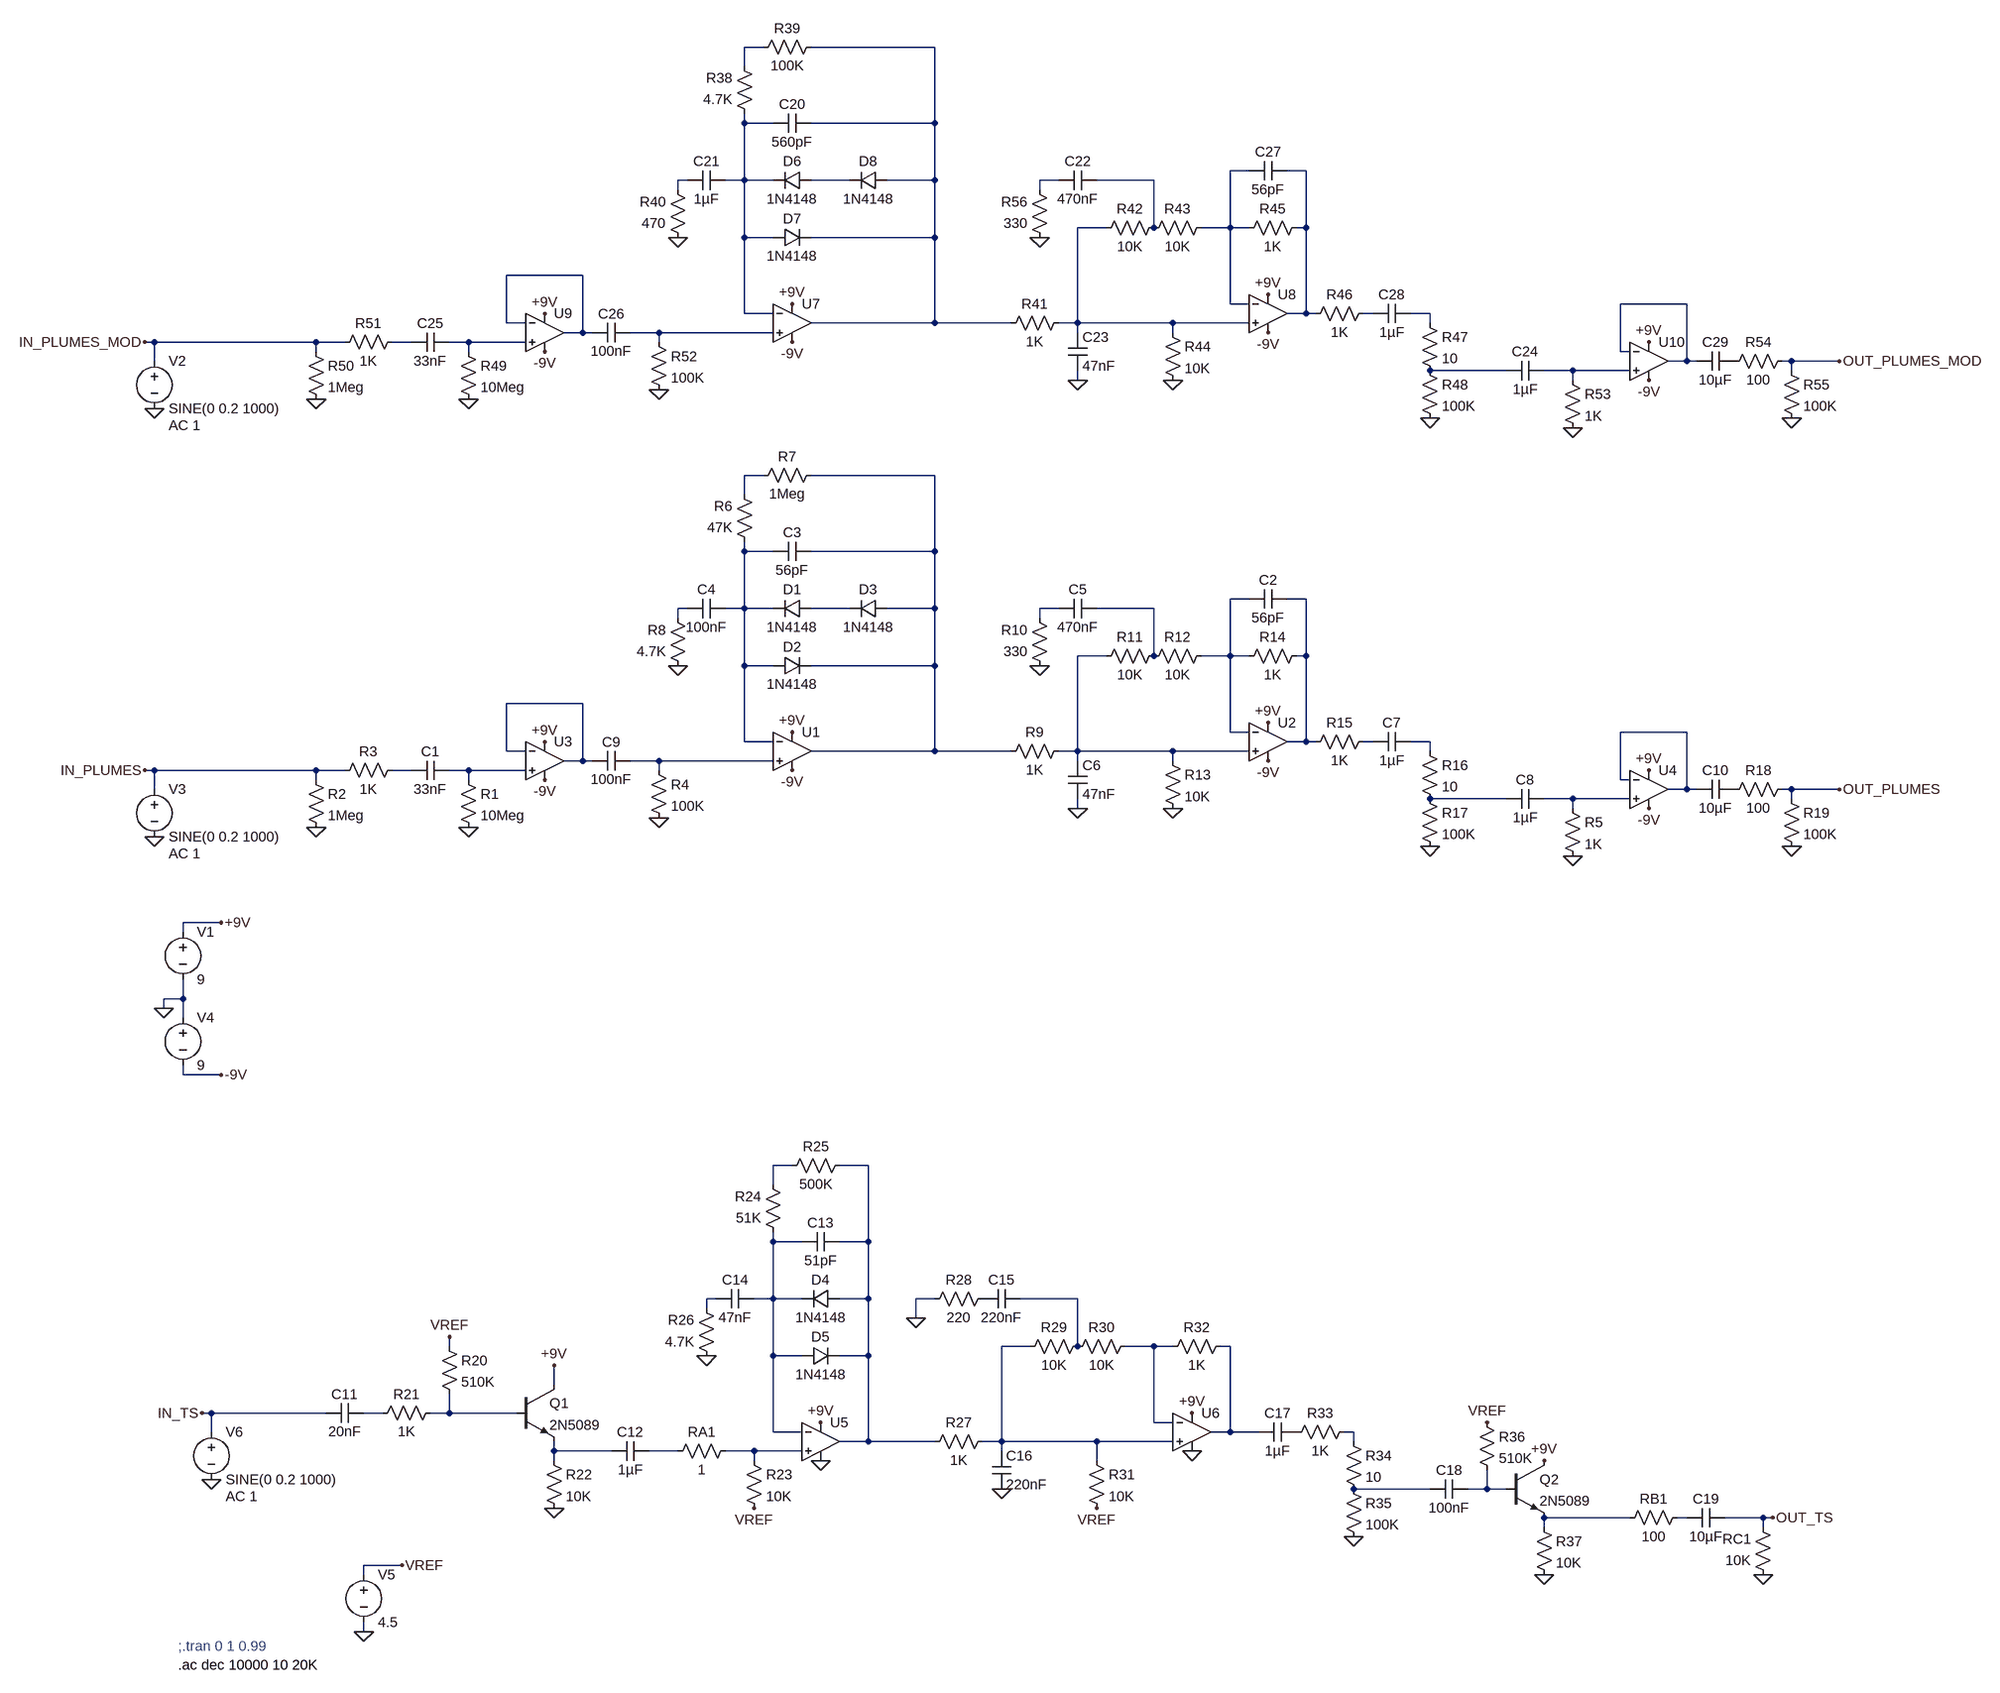
[diagram p0: schematic plumes_TS_sim.asc]
plumes_TS_sim.asc, the LTspice schematic file:
Version 4
SHEET 1 2708 1688
WIRE 608 -1072 576 -1072
WIRE 896 -1072 688 -1072
WIRE 576 -1040 576 -1072
WIRE 576 -944 576 -960
WIRE 624 -944 576 -944
WIRE 896 -944 896 -1072
WIRE 896 -944 688 -944
WIRE 1424 -864 1392 -864
WIRE 1520 -864 1488 -864
WIRE 480 -848 464 -848
WIRE 576 -848 576 -944
WIRE 576 -848 544 -848
WIRE 624 -848 576 -848
WIRE 752 -848 688 -848
WIRE 896 -848 896 -944
WIRE 896 -848 816 -848
WIRE 1104 -848 1072 -848
WIRE 1264 -848 1168 -848
WIRE 464 -832 464 -848
WIRE 1072 -832 1072 -848
WIRE 1184 -768 1136 -768
WIRE 1264 -768 1264 -848
WIRE 1392 -768 1392 -864
WIRE 1392 -768 1344 -768
WIRE 1424 -768 1392 -768
WIRE 1520 -768 1520 -864
WIRE 1520 -768 1504 -768
WIRE 576 -752 576 -848
WIRE 624 -752 576 -752
WIRE 896 -752 896 -848
WIRE 896 -752 688 -752
WIRE 304 -688 176 -688
WIRE 1392 -640 1392 -768
WIRE 1424 -640 1392 -640
WIRE 2160 -640 2048 -640
WIRE 576 -624 576 -752
WIRE 624 -624 576 -624
WIRE 1520 -624 1520 -768
WIRE 1520 -624 1488 -624
WIRE 1536 -624 1520 -624
WIRE 1632 -624 1616 -624
WIRE 1728 -624 1696 -624
WIRE 176 -608 176 -688
WIRE 208 -608 176 -608
WIRE 896 -608 896 -752
WIRE 896 -608 688 -608
WIRE 1024 -608 896 -608
WIRE 1136 -608 1136 -768
WIRE 1136 -608 1104 -608
WIRE 1296 -608 1136 -608
WIRE 1424 -608 1296 -608
WIRE 1728 -608 1728 -624
WIRE 304 -592 304 -688
WIRE 304 -592 272 -592
WIRE 320 -592 304 -592
WIRE 432 -592 384 -592
WIRE 624 -592 432 -592
WIRE 1136 -592 1136 -608
WIRE 1296 -592 1296 -608
WIRE -416 -576 -432 -576
WIRE -144 -576 -416 -576
WIRE -96 -576 -144 -576
WIRE 16 -576 -16 -576
WIRE 112 -576 80 -576
WIRE 208 -576 112 -576
WIRE 432 -576 432 -592
WIRE -144 -560 -144 -576
WIRE 112 -560 112 -576
WIRE 2048 -560 2048 -640
WIRE 2064 -560 2048 -560
WIRE -416 -544 -416 -576
WIRE 2160 -544 2160 -640
WIRE 2160 -544 2128 -544
WIRE 2176 -544 2160 -544
WIRE 2336 -544 2320 -544
WIRE 2416 -544 2336 -544
WIRE 1856 -528 1728 -528
WIRE 1968 -528 1920 -528
WIRE 2064 -528 1968 -528
WIRE 2336 -528 2336 -544
WIRE 1136 -512 1136 -528
WIRE 1968 -512 1968 -528
WIRE 608 -352 576 -352
WIRE 896 -352 688 -352
WIRE 576 -320 576 -352
WIRE 576 -224 576 -240
WIRE 624 -224 576 -224
WIRE 896 -224 896 -352
WIRE 896 -224 688 -224
WIRE 1424 -144 1392 -144
WIRE 1520 -144 1488 -144
WIRE 480 -128 464 -128
WIRE 576 -128 576 -224
WIRE 576 -128 544 -128
WIRE 624 -128 576 -128
WIRE 752 -128 688 -128
WIRE 896 -128 896 -224
WIRE 896 -128 816 -128
WIRE 1104 -128 1072 -128
WIRE 1264 -128 1168 -128
WIRE 464 -112 464 -128
WIRE 1072 -112 1072 -128
WIRE 1184 -48 1136 -48
WIRE 1264 -48 1264 -128
WIRE 1392 -48 1392 -144
WIRE 1392 -48 1344 -48
WIRE 1424 -48 1392 -48
WIRE 1520 -48 1520 -144
WIRE 1520 -48 1504 -48
WIRE 576 -32 576 -128
WIRE 624 -32 576 -32
WIRE 896 -32 896 -128
WIRE 896 -32 688 -32
WIRE 304 32 176 32
WIRE 1392 80 1392 -48
WIRE 1424 80 1392 80
WIRE 2160 80 2048 80
WIRE 576 96 576 -32
WIRE 624 96 576 96
WIRE 1520 96 1520 -48
WIRE 1520 96 1488 96
WIRE 1536 96 1520 96
WIRE 1632 96 1616 96
WIRE 1728 96 1696 96
WIRE 176 112 176 32
WIRE 208 112 176 112
WIRE 896 112 896 -32
WIRE 896 112 688 112
WIRE 1024 112 896 112
WIRE 1136 112 1136 -48
WIRE 1136 112 1104 112
WIRE 1296 112 1136 112
WIRE 1424 112 1296 112
WIRE 1728 112 1728 96
WIRE 304 128 304 32
WIRE 304 128 272 128
WIRE 320 128 304 128
WIRE 432 128 384 128
WIRE 624 128 432 128
WIRE 1136 128 1136 112
WIRE 1296 128 1296 112
WIRE -416 144 -432 144
WIRE -144 144 -416 144
WIRE -96 144 -144 144
WIRE 16 144 -16 144
WIRE 112 144 80 144
WIRE 208 144 112 144
WIRE 432 144 432 128
WIRE -144 160 -144 144
WIRE 112 160 112 144
WIRE 2048 160 2048 80
WIRE 2064 160 2048 160
WIRE -416 176 -416 144
WIRE 2160 176 2160 80
WIRE 2160 176 2128 176
WIRE 2176 176 2160 176
WIRE 2336 176 2320 176
WIRE 2416 176 2336 176
WIRE 1856 192 1728 192
WIRE 1968 192 1920 192
WIRE 2064 192 1968 192
WIRE 2336 192 2336 176
WIRE 1136 208 1136 192
WIRE 1968 208 1968 192
WIRE -304 400 -368 400
WIRE -368 416 -368 400
WIRE -368 528 -368 496
WIRE -368 528 -400 528
WIRE -400 544 -400 528
WIRE -368 560 -368 528
WIRE -368 656 -368 640
WIRE -304 656 -368 656
WIRE 656 832 624 832
WIRE 784 832 736 832
WIRE 624 864 624 832
WIRE 624 960 624 944
WIRE 672 960 624 960
WIRE 784 960 784 832
WIRE 784 960 736 960
WIRE 528 1056 512 1056
WIRE 624 1056 624 960
WIRE 624 1056 592 1056
WIRE 672 1056 624 1056
WIRE 784 1056 784 960
WIRE 784 1056 736 1056
WIRE 896 1056 864 1056
WIRE 1136 1056 1040 1056
WIRE 512 1072 512 1056
WIRE 864 1088 864 1056
WIRE 80 1136 80 1120
WIRE 1056 1136 1008 1136
WIRE 1136 1136 1136 1056
WIRE 1264 1136 1216 1136
WIRE 1296 1136 1264 1136
WIRE 1392 1136 1376 1136
WIRE 624 1152 624 1056
WIRE 672 1152 624 1152
WIRE 784 1152 784 1056
WIRE 784 1152 736 1152
WIRE 256 1200 256 1168
WIRE -320 1248 -336 1248
WIRE -128 1248 -320 1248
WIRE -32 1248 -64 1248
WIRE 80 1248 80 1216
WIRE 80 1248 48 1248
WIRE 192 1248 80 1248
WIRE 1264 1264 1264 1136
WIRE 1296 1264 1264 1264
WIRE -320 1280 -320 1248
WIRE 624 1280 624 1152
WIRE 672 1280 624 1280
WIRE 1392 1280 1392 1136
WIRE 1392 1280 1360 1280
WIRE 1440 1280 1392 1280
WIRE 1600 1280 1584 1280
WIRE 784 1296 784 1152
WIRE 784 1296 736 1296
WIRE 896 1296 784 1296
WIRE 1008 1296 1008 1136
WIRE 1008 1296 976 1296
WIRE 1168 1296 1008 1296
WIRE 1296 1296 1168 1296
WIRE 1600 1296 1600 1280
WIRE 256 1312 256 1296
WIRE 352 1312 256 1312
WIRE 464 1312 416 1312
WIRE 592 1312 544 1312
WIRE 672 1312 592 1312
WIRE 1008 1312 1008 1296
WIRE 256 1328 256 1312
WIRE 592 1328 592 1312
WIRE 1168 1328 1168 1296
WIRE 1728 1376 1600 1376
WIRE 1824 1376 1824 1344
WIRE 1824 1376 1792 1376
WIRE 1856 1376 1824 1376
WIRE 2064 1424 1920 1424
WIRE 2160 1424 2144 1424
WIRE 2288 1424 2224 1424
WIRE 2304 1424 2288 1424
WIRE 1920 1440 1920 1424
WIRE 2288 1440 2288 1424
WIRE 0 1504 -64 1504
WIRE -64 1520 -64 1504
WIRE -64 1616 -64 1600
FLAG -304 400 +9V
FLAG -416 256 0
FLAG -432 144 IN_PLUMES
FLAG 464 -32 0
FLAG 656 80 +9V
FLAG 1136 208 0
FLAG 1456 64 +9V
FLAG 1728 272 0
FLAG -144 240 0
FLAG 112 240 0
FLAG 240 96 +9V
FLAG -400 544 0
FLAG -304 656 -9V
FLAG 240 160 -9V
FLAG 432 224 0
FLAG 1296 208 0
FLAG 1968 288 0
FLAG 656 144 -9V
FLAG 1456 128 -9V
FLAG 2096 208 -9V
FLAG 2096 144 +9V
FLAG 2336 272 0
FLAG 2416 176 OUT_PLUMES
FLAG 1072 -32 0
FLAG 256 1408 0
FLAG -64 1616 0
FLAG 0 1504 VREF
FLAG 256 1168 +9V
FLAG 80 1120 VREF
FLAG 592 1408 VREF
FLAG -320 1360 0
FLAG -336 1248 IN_TS
FLAG 512 1152 0
FLAG 704 1264 +9V
FLAG 704 1328 0
FLAG 864 1088 0
FLAG 1008 1376 0
FLAG 1168 1408 VREF
FLAG 1328 1248 +9V
FLAG 1328 1312 0
FLAG 1600 1456 0
FLAG 1824 1264 VREF
FLAG 1920 1520 0
FLAG 1920 1328 +9V
FLAG 2288 1520 0
FLAG 2304 1424 OUT_TS
FLAG -416 -464 0
FLAG -432 -576 IN_PLUMES_MOD
FLAG 464 -752 0
FLAG 656 -640 +9V
FLAG 1136 -512 0
FLAG 1456 -656 +9V
FLAG 1728 -448 0
FLAG -144 -480 0
FLAG 112 -480 0
FLAG 240 -624 +9V
FLAG 240 -560 -9V
FLAG 432 -496 0
FLAG 1296 -512 0
FLAG 1968 -432 0
FLAG 656 -576 -9V
FLAG 1456 -592 -9V
FLAG 2096 -512 -9V
FLAG 2096 -576 +9V
FLAG 2336 -448 0
FLAG 2416 -544 OUT_PLUMES_MOD
FLAG 1072 -752 0
SYMBOL voltage -368 400 R0
WINDOW 123 0 0 Left 0
WINDOW 39 0 0 Left 0
SYMATTR InstName V1
SYMATTR Value 9
SYMBOL voltage -416 160 R0
WINDOW 123 24 124 Left 2
WINDOW 39 0 0 Left 0
SYMATTR Value2 AC 1
SYMATTR InstName V3
SYMATTR Value SINE(0 0.2 1000)
SYMBOL diode 688 -144 R90
WINDOW 0 0 32 VBottom 2
WINDOW 3 32 32 VTop 2
SYMATTR InstName D1
SYMATTR Value 1N4148
SYMBOL diode 624 -16 R270
WINDOW 0 32 32 VTop 2
WINDOW 3 0 32 VBottom 2
SYMATTR InstName D2
SYMATTR Value 1N4148
SYMBOL cap 688 -240 R90
WINDOW 0 0 32 VBottom 2
WINDOW 3 32 32 VTop 2
SYMATTR InstName C3
SYMATTR Value 56pF
SYMBOL res 592 -224 R180
WINDOW 0 36 76 Left 2
WINDOW 3 36 40 Left 2
SYMATTR InstName R6
SYMATTR Value 47K
SYMBOL res 704 -368 R90
WINDOW 0 0 56 VBottom 2
WINDOW 3 32 56 VTop 2
SYMATTR InstName R7
SYMATTR Value 1Meg
SYMBOL cap 544 -144 R90
WINDOW 0 0 32 VBottom 2
WINDOW 3 32 32 VTop 2
SYMATTR InstName C4
SYMATTR Value 100nF
SYMBOL res 480 -16 R180
WINDOW 0 36 76 Left 2
WINDOW 3 36 40 Left 2
SYMATTR InstName R8
SYMATTR Value 4.7K
SYMBOL res 1120 96 R90
WINDOW 0 0 56 VBottom 2
WINDOW 3 32 56 VTop 2
SYMATTR InstName R9
SYMATTR Value 1K
SYMBOL cap 1168 -144 R90
WINDOW 0 0 32 VBottom 2
WINDOW 3 32 32 VTop 2
SYMATTR InstName C5
SYMATTR Value 470nF
SYMBOL res 1280 -64 R90
WINDOW 0 0 56 VBottom 2
WINDOW 3 32 56 VTop 2
SYMATTR InstName R11
SYMATTR Value 10K
SYMBOL res 1360 -64 R90
WINDOW 0 0 56 VBottom 2
WINDOW 3 32 56 VTop 2
SYMATTR InstName R12
SYMATTR Value 10K
SYMBOL cap 1120 128 R0
SYMATTR InstName C6
SYMATTR Value 47nF
SYMBOL res 1280 112 R0
SYMATTR InstName R13
SYMATTR Value 10K
SYMBOL res 1520 -64 R90
WINDOW 0 0 56 VBottom 2
WINDOW 3 32 56 VTop 2
SYMATTR InstName R14
SYMATTR Value 1K
SYMBOL res 1632 80 R90
WINDOW 0 0 56 VBottom 2
WINDOW 3 32 56 VTop 2
SYMATTR InstName R15
SYMATTR Value 1K
SYMBOL res 1712 96 R0
SYMATTR InstName R16
SYMATTR Value 10
SYMBOL res 1712 176 R0
SYMATTR InstName R17
SYMATTR Value 100K
SYMBOL cap 1920 176 R90
WINDOW 0 0 32 VBottom 2
WINDOW 3 32 32 VTop 2
SYMATTR InstName C8
SYMATTR Value 1µF
SYMBOL UniversalOpAmp2 656 112 R0
SYMATTR InstName U1
SYMBOL UniversalOpAmp2 1456 96 R0
SYMATTR InstName U2
SYMBOL UniversalOpAmp2 240 128 R0
SYMATTR InstName U3
SYMBOL res 96 144 R0
SYMATTR InstName R1
SYMATTR Value 10Meg
SYMBOL res -160 144 R0
SYMATTR InstName R2
SYMATTR Value 1Meg
SYMBOL res 0 128 R90
WINDOW 0 0 56 VBottom 2
WINDOW 3 32 56 VTop 2
SYMATTR InstName R3
SYMATTR Value 1K
SYMBOL cap 80 128 R90
WINDOW 0 0 32 VBottom 2
WINDOW 3 32 32 VTop 2
SYMATTR InstName C1
SYMATTR Value 33nF
SYMBOL voltage -368 544 R0
WINDOW 123 0 0 Left 0
WINDOW 39 0 0 Left 0
SYMATTR InstName V4
SYMATTR Value 9
SYMBOL cap 384 112 R90
WINDOW 0 0 32 VBottom 2
WINDOW 3 32 32 VTop 2
SYMATTR InstName C9
SYMATTR Value 100nF
SYMBOL res 416 128 R0
SYMATTR InstName R4
SYMATTR Value 100K
SYMBOL cap 1488 -160 R90
WINDOW 0 0 32 VBottom 2
WINDOW 3 32 32 VTop 2
SYMATTR InstName C2
SYMATTR Value 56pF
SYMBOL cap 1696 80 R90
WINDOW 0 0 32 VBottom 2
WINDOW 3 32 32 VTop 2
SYMATTR InstName C7
SYMATTR Value 1µF
SYMBOL res 1952 192 R0
SYMATTR InstName R5
SYMATTR Value 1K
SYMBOL UniversalOpAmp2 2096 176 R0
SYMATTR InstName U4
SYMBOL cap 2240 160 R90
WINDOW 0 0 32 VBottom 2
WINDOW 3 32 32 VTop 2
SYMATTR InstName C10
SYMATTR Value 10µF
SYMBOL res 2336 160 R90
WINDOW 0 0 56 VBottom 2
WINDOW 3 32 56 VTop 2
SYMATTR InstName R18
SYMATTR Value 100
SYMBOL res 2320 176 R0
SYMATTR InstName R19
SYMATTR Value 100K
SYMBOL diode 816 -144 R90
WINDOW 0 0 32 VBottom 2
WINDOW 3 32 32 VTop 2
SYMATTR InstName D3
SYMATTR Value 1N4148
SYMBOL res 1088 -16 R180
WINDOW 0 36 76 Left 2
WINDOW 3 36 40 Left 2
SYMATTR InstName R10
SYMATTR Value 330
SYMBOL npn 192 1200 R0
SYMATTR InstName Q1
SYMATTR Value 2N5089
SYMBOL res 64 1120 R0
SYMATTR InstName R20
SYMATTR Value 510K
SYMBOL res 64 1232 R90
WINDOW 0 0 56 VBottom 2
WINDOW 3 32 56 VTop 2
SYMATTR InstName R21
SYMATTR Value 1K
SYMBOL res 240 1312 R0
SYMATTR InstName R22
SYMATTR Value 10K
SYMBOL res 560 1296 R90
WINDOW 0 0 56 VBottom 2
WINDOW 3 32 56 VTop 2
SYMATTR InstName RA1
SYMATTR Value 1
SYMBOL res 576 1312 R0
SYMATTR InstName R23
SYMATTR Value 10K
SYMBOL cap -64 1232 R90
WINDOW 0 0 32 VBottom 2
WINDOW 3 32 32 VTop 2
SYMATTR InstName C11
SYMATTR Value 20nF
SYMBOL cap 416 1296 R90
WINDOW 0 0 32 VBottom 2
WINDOW 3 32 32 VTop 2
SYMATTR InstName C12
SYMATTR Value 1µF
SYMBOL voltage -64 1504 R0
WINDOW 123 0 0 Left 0
WINDOW 39 0 0 Left 0
SYMATTR InstName V5
SYMATTR Value 4.5
SYMBOL voltage -320 1264 R0
WINDOW 123 24 124 Left 2
WINDOW 39 0 0 Left 0
SYMATTR Value2 AC 1
SYMATTR InstName V6
SYMATTR Value SINE(0 0.2 1000)
SYMBOL diode 736 1040 R90
WINDOW 0 0 32 VBottom 2
WINDOW 3 32 32 VTop 2
SYMATTR InstName D4
SYMATTR Value 1N4148
SYMBOL diode 672 1168 R270
WINDOW 0 32 32 VTop 2
WINDOW 3 0 32 VBottom 2
SYMATTR InstName D5
SYMATTR Value 1N4148
SYMBOL cap 736 944 R90
WINDOW 0 0 32 VBottom 2
WINDOW 3 32 32 VTop 2
SYMATTR InstName C13
SYMATTR Value 51pF
SYMBOL res 640 960 R180
WINDOW 0 36 76 Left 2
WINDOW 3 36 40 Left 2
SYMATTR InstName R24
SYMATTR Value 51K
SYMBOL res 752 816 R90
WINDOW 0 0 56 VBottom 2
WINDOW 3 32 56 VTop 2
SYMATTR InstName R25
SYMATTR Value 500K
SYMBOL cap 592 1040 R90
WINDOW 0 0 32 VBottom 2
WINDOW 3 32 32 VTop 2
SYMATTR InstName C14
SYMATTR Value 47nF
SYMBOL res 528 1168 R180
WINDOW 0 36 76 Left 2
WINDOW 3 36 40 Left 2
SYMATTR InstName R26
SYMATTR Value 4.7K
SYMBOL res 992 1280 R90
WINDOW 0 0 56 VBottom 2
WINDOW 3 32 56 VTop 2
SYMATTR InstName R27
SYMATTR Value 1K
SYMBOL res 992 1040 R90
WINDOW 0 0 56 VBottom 2
WINDOW 3 32 56 VTop 2
SYMATTR InstName R28
SYMATTR Value 220
SYMBOL cap 1040 1040 R90
WINDOW 0 0 32 VBottom 2
WINDOW 3 32 32 VTop 2
SYMATTR InstName C15
SYMATTR Value 220nF
SYMBOL res 1152 1120 R90
WINDOW 0 0 56 VBottom 2
WINDOW 3 32 56 VTop 2
SYMATTR InstName R29
SYMATTR Value 10K
SYMBOL res 1232 1120 R90
WINDOW 0 0 56 VBottom 2
WINDOW 3 32 56 VTop 2
SYMATTR InstName R30
SYMATTR Value 10K
SYMBOL cap 992 1312 R0
SYMATTR InstName C16
SYMATTR Value 220nF
SYMBOL res 1152 1312 R0
SYMATTR InstName R31
SYMATTR Value 10K
SYMBOL res 1392 1120 R90
WINDOW 0 0 56 VBottom 2
WINDOW 3 32 56 VTop 2
SYMATTR InstName R32
SYMATTR Value 1K
SYMBOL cap 1504 1264 R90
WINDOW 0 0 32 VBottom 2
WINDOW 3 32 32 VTop 2
SYMATTR InstName C17
SYMATTR Value 1µF
SYMBOL res 1600 1264 R90
WINDOW 0 0 56 VBottom 2
WINDOW 3 32 56 VTop 2
SYMATTR InstName R33
SYMATTR Value 1K
SYMBOL res 1584 1280 R0
SYMATTR InstName R34
SYMATTR Value 10
SYMBOL res 1584 1360 R0
SYMATTR InstName R35
SYMATTR Value 100K
SYMBOL cap 1792 1360 R90
WINDOW 0 0 32 VBottom 2
WINDOW 3 32 32 VTop 2
SYMATTR InstName C18
SYMATTR Value 100nF
SYMBOL res 1808 1248 R0
SYMATTR InstName R36
SYMATTR Value 510K
SYMBOL res 1904 1424 R0
SYMATTR InstName R37
SYMATTR Value 10K
SYMBOL npn 1856 1328 R0
SYMATTR InstName Q2
SYMATTR Value 2N5089
SYMBOL res 2160 1408 R90
WINDOW 0 0 56 VBottom 2
WINDOW 3 32 56 VTop 2
SYMATTR InstName RB1
SYMATTR Value 100
SYMBOL res 2304 1536 R180
WINDOW 0 36 76 Left 2
WINDOW 3 36 40 Left 2
SYMATTR InstName RC1
SYMATTR Value 10K
SYMBOL cap 2224 1408 R90
WINDOW 0 0 32 VBottom 2
WINDOW 3 32 32 VTop 2
SYMATTR InstName C19
SYMATTR Value 10µF
SYMBOL UniversalOpAmp2 704 1296 R0
SYMATTR InstName U5
SYMBOL UniversalOpAmp2 1328 1280 R0
SYMATTR InstName U6
SYMBOL voltage -416 -560 R0
WINDOW 123 24 124 Left 2
WINDOW 39 0 0 Left 0
SYMATTR Value2 AC 1
SYMATTR InstName V2
SYMATTR Value SINE(0 0.2 1000)
SYMBOL diode 688 -864 R90
WINDOW 0 0 32 VBottom 2
WINDOW 3 32 32 VTop 2
SYMATTR InstName D6
SYMATTR Value 1N4148
SYMBOL diode 624 -736 R270
WINDOW 0 32 32 VTop 2
WINDOW 3 0 32 VBottom 2
SYMATTR InstName D7
SYMATTR Value 1N4148
SYMBOL cap 688 -960 R90
WINDOW 0 0 32 VBottom 2
WINDOW 3 32 32 VTop 2
SYMATTR InstName C20
SYMATTR Value 560pF
SYMBOL res 592 -944 R180
WINDOW 0 36 76 Left 2
WINDOW 3 36 40 Left 2
SYMATTR InstName R38
SYMATTR Value 4.7K
SYMBOL res 704 -1088 R90
WINDOW 0 0 56 VBottom 2
WINDOW 3 32 56 VTop 2
SYMATTR InstName R39
SYMATTR Value 100K
SYMBOL cap 544 -864 R90
WINDOW 0 0 32 VBottom 2
WINDOW 3 32 32 VTop 2
SYMATTR InstName C21
SYMATTR Value 1µF
SYMBOL res 480 -736 R180
WINDOW 0 36 76 Left 2
WINDOW 3 36 40 Left 2
SYMATTR InstName R40
SYMATTR Value 470
SYMBOL res 1120 -624 R90
WINDOW 0 0 56 VBottom 2
WINDOW 3 32 56 VTop 2
SYMATTR InstName R41
SYMATTR Value 1K
SYMBOL cap 1168 -864 R90
WINDOW 0 0 32 VBottom 2
WINDOW 3 32 32 VTop 2
SYMATTR InstName C22
SYMATTR Value 470nF
SYMBOL res 1280 -784 R90
WINDOW 0 0 56 VBottom 2
WINDOW 3 32 56 VTop 2
SYMATTR InstName R42
SYMATTR Value 10K
SYMBOL res 1360 -784 R90
WINDOW 0 0 56 VBottom 2
WINDOW 3 32 56 VTop 2
SYMATTR InstName R43
SYMATTR Value 10K
SYMBOL cap 1120 -592 R0
SYMATTR InstName C23
SYMATTR Value 47nF
SYMBOL res 1280 -608 R0
SYMATTR InstName R44
SYMATTR Value 10K
SYMBOL res 1520 -784 R90
WINDOW 0 0 56 VBottom 2
WINDOW 3 32 56 VTop 2
SYMATTR InstName R45
SYMATTR Value 1K
SYMBOL res 1632 -640 R90
WINDOW 0 0 56 VBottom 2
WINDOW 3 32 56 VTop 2
SYMATTR InstName R46
SYMATTR Value 1K
SYMBOL res 1712 -624 R0
SYMATTR InstName R47
SYMATTR Value 10
SYMBOL res 1712 -544 R0
SYMATTR InstName R48
SYMATTR Value 100K
SYMBOL cap 1920 -544 R90
WINDOW 0 0 32 VBottom 2
WINDOW 3 32 32 VTop 2
SYMATTR InstName C24
SYMATTR Value 1µF
SYMBOL UniversalOpAmp2 656 -608 R0
SYMATTR InstName U7
SYMBOL UniversalOpAmp2 1456 -624 R0
SYMATTR InstName U8
SYMBOL UniversalOpAmp2 240 -592 R0
SYMATTR InstName U9
SYMBOL res 96 -576 R0
SYMATTR InstName R49
SYMATTR Value 10Meg
SYMBOL res -160 -576 R0
SYMATTR InstName R50
SYMATTR Value 1Meg
SYMBOL res 0 -592 R90
WINDOW 0 0 56 VBottom 2
WINDOW 3 32 56 VTop 2
SYMATTR InstName R51
SYMATTR Value 1K
SYMBOL cap 80 -592 R90
WINDOW 0 0 32 VBottom 2
WINDOW 3 32 32 VTop 2
SYMATTR InstName C25
SYMATTR Value 33nF
SYMBOL cap 384 -608 R90
WINDOW 0 0 32 VBottom 2
WINDOW 3 32 32 VTop 2
SYMATTR InstName C26
SYMATTR Value 100nF
SYMBOL res 416 -592 R0
SYMATTR InstName R52
SYMATTR Value 100K
SYMBOL cap 1488 -880 R90
WINDOW 0 0 32 VBottom 2
WINDOW 3 32 32 VTop 2
SYMATTR InstName C27
SYMATTR Value 56pF
SYMBOL cap 1696 -640 R90
WINDOW 0 0 32 VBottom 2
WINDOW 3 32 32 VTop 2
SYMATTR InstName C28
SYMATTR Value 1µF
SYMBOL res 1952 -528 R0
SYMATTR InstName R53
SYMATTR Value 1K
SYMBOL UniversalOpAmp2 2096 -544 R0
SYMATTR InstName U10
SYMBOL cap 2240 -560 R90
WINDOW 0 0 32 VBottom 2
WINDOW 3 32 32 VTop 2
SYMATTR InstName C29
SYMATTR Value 10µF
SYMBOL res 2336 -560 R90
WINDOW 0 0 56 VBottom 2
WINDOW 3 32 56 VTop 2
SYMATTR InstName R54
SYMATTR Value 100
SYMBOL res 2320 -544 R0
SYMATTR InstName R55
SYMATTR Value 100K
SYMBOL diode 816 -864 R90
WINDOW 0 0 32 VBottom 2
WINDOW 3 32 32 VTop 2
SYMATTR InstName D8
SYMATTR Value 1N4148
SYMBOL res 1088 -736 R180
WINDOW 0 36 76 Left 2
WINDOW 3 36 40 Left 2
SYMATTR InstName R56
SYMATTR Value 330
TEXT -376 1640 Left 2 ;;.tran 0 1 0.99
TEXT -376 1672 Left 2 !.ac dec 10000 10 20K

The netlist it stands for:
* plumes_TS_sim.asc
V1 +9V 0 9
V3 IN_PLUMES 0 SINE(0 0.2 1000) AC 1
D1 N026 N022 1N4148
D2 N022 N021 1N4148
C3 N021 N022 56pF
R6 N022 N020 47K
R7 N021 N020 1Meg
C4 N022 N025 100nF
R8 0 N025 4.7K
R9 N029 N021 1K
C5 N028 N027 470nF
R11 N028 N029 10K
R12 N023 N028 10K
C6 N029 0 47nF
R13 N029 0 10K
R14 N024 N023 1K
R15 N032 N024 1K
R16 N033 N037 10
R17 N037 0 100K
C8 N038 N037 1µF
XU1 N034 N022 +9V -9V N021 level2 Avol=1Meg GBW=10Meg Slew=10Meg Ilimit=25m Rail=0 Vos=0 En=0 Enk=0 In=0 Ink=0 Rin=500Meg  ; pins In+ In- V+ V- OUT
XU2 N029 N023 +9V -9V N024 level2 Avol=1Meg GBW=10Meg Slew=10Meg Ilimit=25m Rail=0 Vos=0 En=0 Enk=0 In=0 Ink=0 Rin=500Meg  ; pins In+ In- V+ V- OUT
XU3 N036 N030 +9V -9V N030 level2 Avol=1Meg GBW=10Meg Slew=10Meg Ilimit=25m Rail=0 Vos=0 En=0 Enk=0 In=0 Ink=0 Rin=500Meg  ; pins In+ In- V+ V- OUT
R1 N036 0 10Meg
R2 IN_PLUMES 0 1Meg
R3 N035 IN_PLUMES 1K
C1 N036 N035 33nF
V4 0 -9V 9
C9 N034 N030 100nF
R4 N034 0 100K
C2 N024 N023 56pF
C7 N033 N032 1µF
R5 N038 0 1K
XU4 N038 N031 +9V -9V N031 level2 Avol=1Meg GBW=10Meg Slew=10Meg Ilimit=25m Rail=0 Vos=0 En=0 Enk=0 In=0 Ink=0 Rin=500Meg  ; pins In+ In- V+ V- OUT
C10 P001 N031 10µF
R18 OUT_PLUMES P001 100
R19 OUT_PLUMES 0 100K
D3 N021 N026 1N4148
R10 0 N027 330
Q1 +9V N048 N050 0 2N5089
R20 VREF N048 510K
R21 N048 N047 1K
R22 N050 0 10K
RA1 N052 N051 1
R23 N052 VREF 10K
C11 N047 IN_TS 20nF
C12 N051 N050 1µF
V5 VREF 0 4.5
V6 IN_TS 0 SINE(0 0.2 1000) AC 1
D4 N040 N041 1N4148
D5 N041 N040 1N4148
C13 N040 N041 51pF
R24 N041 N039 51K
R25 N040 N039 500K
C14 N041 N042 47nF
R26 0 N042 4.7K
R27 N044 N040 1K
R28 P002 0 220
C15 N043 P002 220nF
R29 N043 N044 10K
R30 N045 N043 10K
C16 N044 0 220nF
R31 N044 VREF 10K
R32 N046 N045 1K
C17 P003 N046 1µF
R33 N049 P003 1K
R34 N049 N053 10
R35 N053 0 100K
C18 N054 N053 100nF
R36 VREF N054 510K
R37 N055 0 10K
Q2 +9V N054 N055 0 2N5089
RB1 N056 N055 100
RC1 0 OUT_TS 10K
C19 OUT_TS N056 10µF
XU5 N052 N041 +9V 0 N040 level2 Avol=1Meg GBW=10Meg Slew=10Meg Ilimit=25m Rail=0 Vos=0 En=0 Enk=0 In=0 Ink=0 Rin=500Meg  ; pins In+ In- V+ V- OUT
XU6 N044 N045 +9V 0 N046 level2 Avol=1Meg GBW=10Meg Slew=10Meg Ilimit=25m Rail=0 Vos=0 En=0 Enk=0 In=0 Ink=0 Rin=500Meg  ; pins In+ In- V+ V- OUT
V2 IN_PLUMES_MOD 0 SINE(0 0.2 1000) AC 1
D6 N007 N003 1N4148
D7 N003 N002 1N4148
C20 N002 N003 560pF
R38 N003 N001 4.7K
R39 N002 N001 100K
C21 N003 N006 1µF
R40 0 N006 470
R41 N010 N002 1K
C22 N009 N008 470nF
R42 N009 N010 10K
R43 N004 N009 10K
C23 N010 0 47nF
R44 N010 0 10K
R45 N005 N004 1K
R46 N013 N005 1K
R47 N014 N018 10
R48 N018 0 100K
C24 N019 N018 1µF
XU7 N015 N003 +9V -9V N002 level2 Avol=1Meg GBW=10Meg Slew=10Meg Ilimit=25m Rail=0 Vos=0 En=0 Enk=0 In=0 Ink=0 Rin=500Meg  ; pins In+ In- V+ V- OUT
XU8 N010 N004 +9V -9V N005 level2 Avol=1Meg GBW=10Meg Slew=10Meg Ilimit=25m Rail=0 Vos=0 En=0 Enk=0 In=0 Ink=0 Rin=500Meg  ; pins In+ In- V+ V- OUT
XU9 N017 N011 +9V -9V N011 level2 Avol=1Meg GBW=10Meg Slew=10Meg Ilimit=25m Rail=0 Vos=0 En=0 Enk=0 In=0 Ink=0 Rin=500Meg  ; pins In+ In- V+ V- OUT
R49 N017 0 10Meg
R50 IN_PLUMES_MOD 0 1Meg
R51 N016 IN_PLUMES_MOD 1K
C25 N017 N016 33nF
C26 N015 N011 100nF
R52 N015 0 100K
C27 N005 N004 56pF
C28 N014 N013 1µF
R53 N019 0 1K
XU10 N019 N012 +9V -9V N012 level2 Avol=1Meg GBW=10Meg Slew=10Meg Ilimit=25m Rail=0 Vos=0 En=0 Enk=0 In=0 Ink=0 Rin=500Meg  ; pins In+ In- V+ V- OUT
C29 P004 N012 10µF
R54 OUT_PLUMES_MOD P004 100
R55 OUT_PLUMES_MOD 0 100K
D8 N002 N007 1N4148
R56 0 N008 330
.model D D
.lib standard.dio
.model NPN NPN
.model PNP PNP
.lib standard.bjt
* ;.tran 0 1 0.99
.ac dec 10000 10 20K
.lib UniversalOpAmp2.lib
.backanno
.end